# EAGLE design SK3000v3 - FINAL (EAGLE 7.1.0)
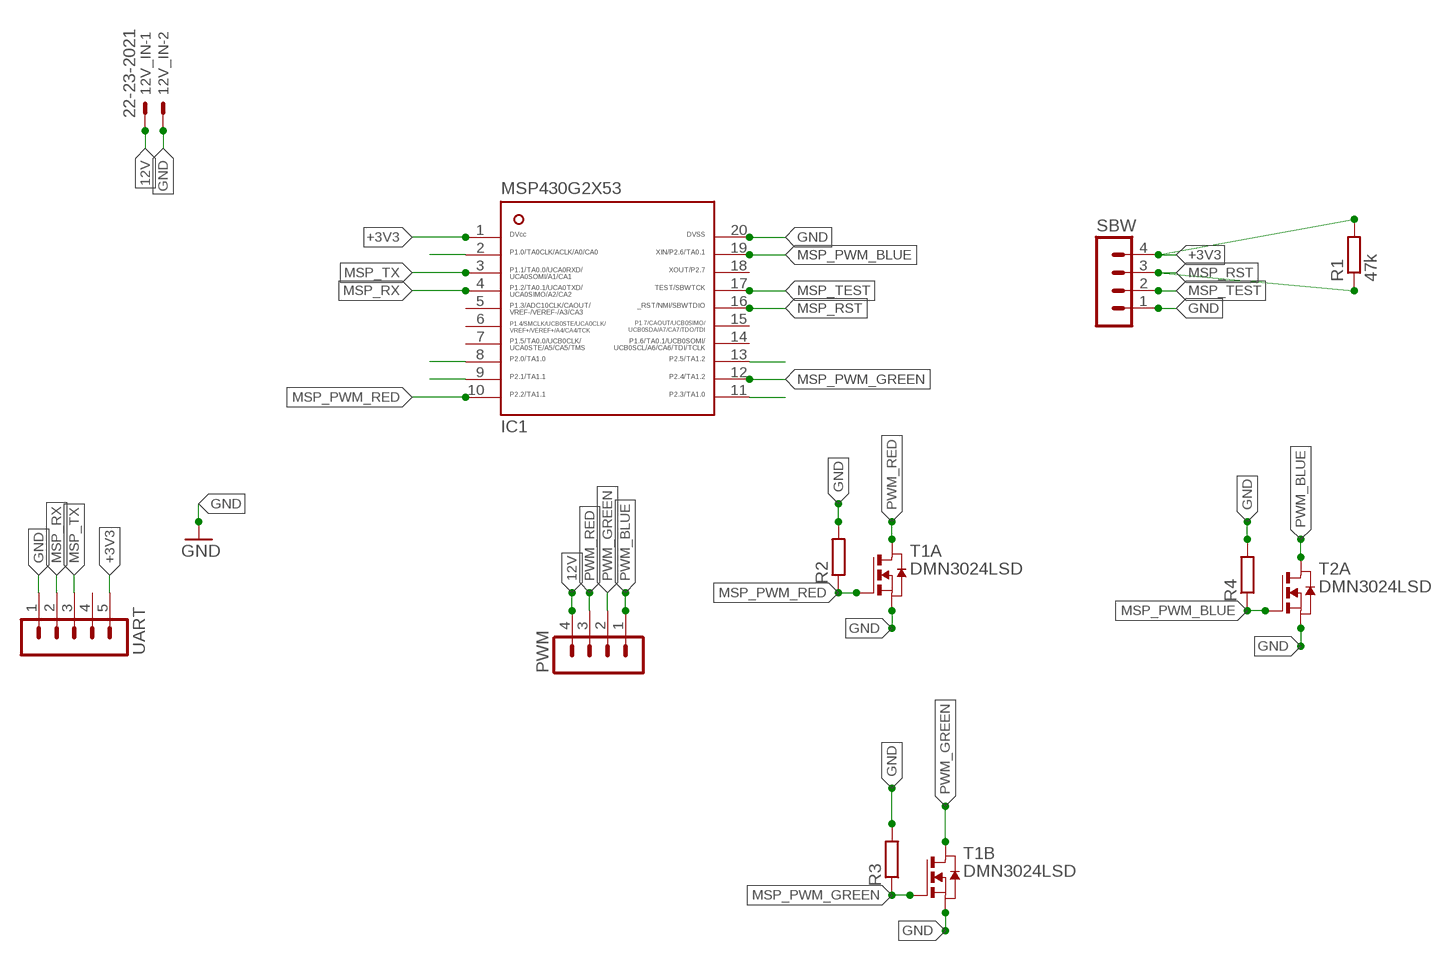
[diagram p0: schematic, sheet 1]

## Parts
12V_IN  22-23-2021  [22-23-2021]
IC1  MSP430G2553  MSP430G2X53-20PW20  [PW20]
PWM  MA04-1  [MA04-1]
R1  47k  R-EU_0207/5V  [0207/5V]
R2  R-EU_0207/5V  [0207/5V]
R3  R-EU_0207/5V  [0207/5V]
R4  R-EU_0207/5V  [0207/5V]
SBW  MA04-1  [MA04-1]
T1  DMN3024LSD  [SO8]
T2  DMN3024LSD  [SO8]
UART  MA05-1  [MA05-1]

## Nets
12V: 12V_IN.1 PWM.4
+3V3: IC1.1 R1.2 SBW.4 UART.5
GND: 12V_IN.2 IC1.20 R2.2 R3.2 R4.2 SBW.1 T1.1(A:S) T1.3(B:S) T2.1(A:S) UART.1
MSP_PWM_BLUE: IC1.19 R4.1 T2.2(A:G)
MSP_PWM_GREEN: IC1.12 R3.1 T1.4(B:G)
MSP_PWM_RED: IC1.10 R2.1 T1.2(A:G)
MSP_RST: IC1.16 R1.1 SBW.3
MSP_RX: IC1.4 UART.2
MSP_TEST: IC1.17 SBW.2
MSP_TX: IC1.3 UART.3
N$32: IC1.2
N$33: IC1.8
N$34: IC1.9
N$36: IC1.13
N$37: IC1.11
PWM_BLUE: PWM.1 T2.7(A:D) T2.8(A:D)
PWM_GREEN: PWM.2 T1.5(B:D) T1.6(B:D)
PWM_RED: PWM.3 T1.7(A:D) T1.8(A:D)
Unconnected: IC1.5 IC1.6 IC1.7 IC1.14 IC1.15 IC1.18 T2.3(B:S) T2.4(B:G) T2.5(B:D) T2.6(B:D) UART.4

## Library data of the parts
12V_IN = con-molex:22-23-2021: .100" (2.54mm) Center Header - 2 Pin; MF: MOLEX; MPN: 22-23-2021; OC_FARNELL: 1462926; OC_NEWARK: 25C3832
IC1 = ti_msp430:MSP430G2X53-20
PWM SBW = con-lstb:MA04-1: PIN HEADER; OC_FARNELL: unknown; OC_NEWARK: unknown
R1-R4 = rcl:R-EU_: RESISTOR, European symbol
T1 T2 = zetex:DMN3024LSD: 30V DUAL N-CHANNEL ENHANCEMENT MODE MOSFET Source: Data sheet <http://www.diodes.com/datasheets/DMN3024LSD.pdf>; OC_FARNELL: unknown; OC_NEWARK: unknown
UART = con-lstb:MA05-1: PIN HEADER; OC_FARNELL: unknown; OC_NEWARK: unknown

## Board
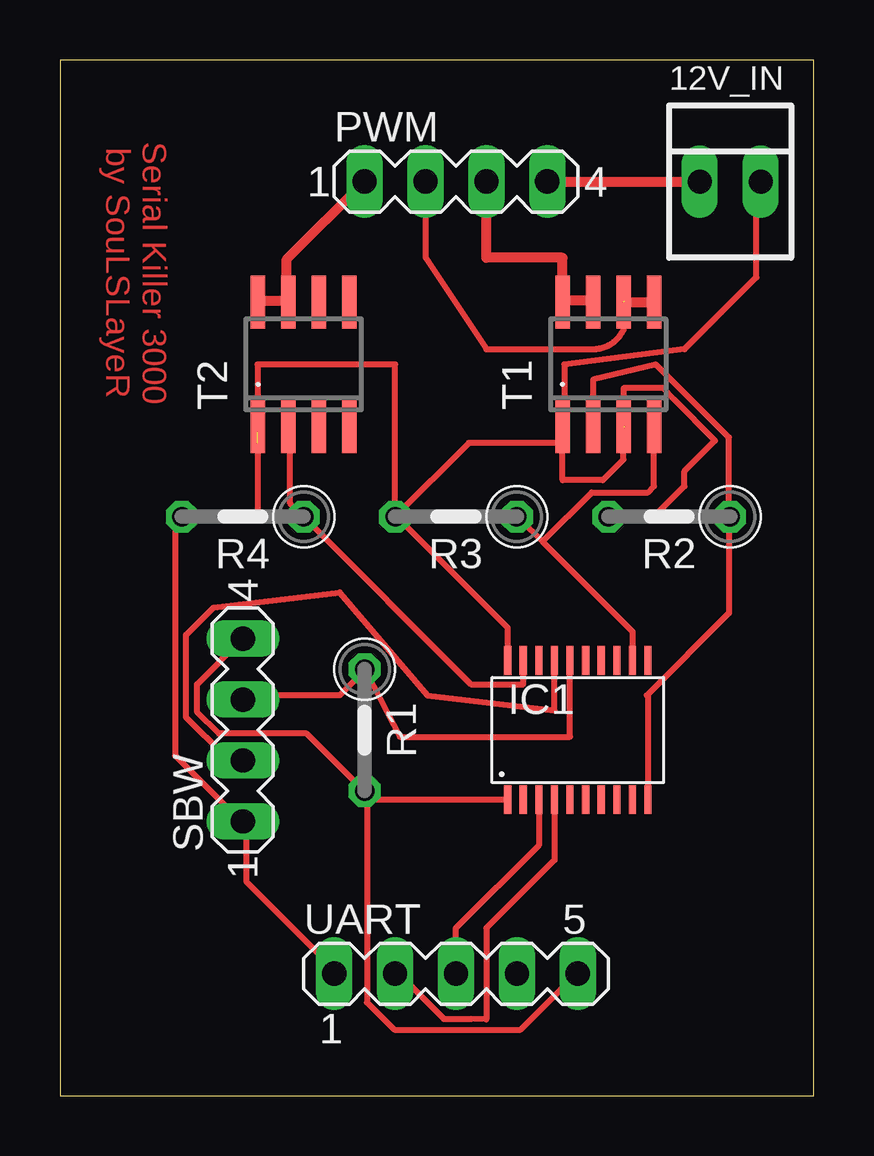
[diagram p1: board, top side]

Size 31.42 x 43.17 mm. Coordinates in mm from the lower left corner, seen from the top.
Outline: 0,0 31.42,0 31.42,43.17 0,43.17 0,0
Copper layers (1*16): Top 0.035mm / dielectric 1.5mm / Bottom 0.035mm
Design rules "default": minimum track width 10mil, minimum drill 24mil, track to track 8mil, track to pad 8mil, pad to pad 8mil, via to via 8mil, smd to smd 8mil, copper to edge 40mil, drill to drill 8mil, minimum pad ring 10mil, minimum via ring 8mil, stop-mask expansion 4mil, vias tented up to drill 0mil, thermal gap 10mil

### Footprints (pad centres in the part's own frame; a part is rotated, then mirrored left to right if it is on the bottom)
22-23-2021 = drill 1 long: 1 -1.27,0; 2 1.27,0
PW20 = smd 0.3 x 1.2: 1 -2.925,-2.9; 2 -2.275,-2.9; 3 -1.625,-2.9; 4 -0.975,-2.9; 5 -0.325,-2.9; 6 0.325,-2.9; 7 0.975,-2.9; 8 1.625,-2.9; 9 2.275,-2.9; 10 2.925,-2.9; 11 2.925,2.9; 12 2.275,2.9; 13 1.625,2.9; 14 0.975,2.9; 15 0.325,2.9; 16 -0.325,2.9; 17 -0.975,2.9; 18 -1.625,2.9; 19 -2.275,2.9; 20 -2.925,2.9
MA04-1 = drill 1.016 long: 1 -3.81,0; 2 -1.27,0; 3 1.27,0; 4 3.81,0
0207/5V = drill 0.813 octagon: 1 -2.54,0; 2 2.54,0
SO8 = smd 0.6 x 2.2: 1 -1.905,-2.6; 2 -0.635,-2.6; 3 0.635,-2.6; 4 1.905,-2.6; 5 1.905,2.6; 6 0.635,2.6; 7 -0.635,2.6; 8 -1.905,2.6
MA05-1 = drill 1.016 long: 1 -5.08,0; 2 -2.54,0; 3 0,0; 4 2.54,0; 5 5.08,0

### Placement (x,y rotation side)
12V_IN  27.94,38.1 0 top
IC1  21.59,15.24 0 top
PWM  16.51,38.1 0 top
R1  12.7,15.24 270 top
R2  25.4,24.13 180 top
R3  16.51,24.13 180 top
R4  7.62,24.13 180 top
SBW  7.62,15.24 90 top
T1  22.86,30.48 0 top
T2  10.16,30.48 0 top
UART  16.51,5.08 0 top

### Tracks (layer width: path | path; a pad name or v marks a point on that pad's centre or on a via)
12V
  Top 0.406: PWM.4 12V_IN.1
+3V3
  Top 0.254: 12.8,12.57 13.03,12.34 18.52,12.34 IC1.1 | SBW.4 5.71,17.14 5.71,16 6.63,15.09 10.29,15.09 12.57,12.8 R1.2 12.8,12.57 | 12.8,12.57 12.8,3.89 13.95,2.74 19.2,2.74 21.49,5.03 UART.5
GND  (2 unrouted)
  Top 0.254: 21.03,27.2 21.03,27.66 T1.1 | 23.55,27.89 23.55,28.57 | 22.86,24.23 R2.2 24.77,24.13 26.04,25.4 26.04,26.04 27.3,27.3 25.6,29.03 25.15,29.49 23.5,29.49 T1.3 23.5,26.52 22.63,25.65 20.95,25.65 20.95,27.2 | 12V_IN.2 29.03,37.95 29.03,34.11 26.04,31.11 21.03,30.48 21.03,27.89 T1.1 | UART.1 11.43,5.26 7.77,8.91 7.77,11.43 SBW.1 7.54,11.43 4.8,14.17 4.8,23.77 5.03,24 R4.2 5.26,24.23 8.26,24.23 8.26,27.2 | T2.1 8.23,27.66 8.23,30.48 13.97,30.48 R3.2 | R3.2 14.17,24 18.66,19.51 IC1.20 | 13.95,24 R3.2 | 20.95,27.2 21.03,27.2 | 21.03,27.2 T1.1 | 20.95,27.2 17.04,27.2 R3.2
  Top 0.406: 8.23,27.2 8.26,27.2
MSP_PWM_BLUE
  Top 0.254: T2.2 9.6,27.66 9.6,24.69 R4.1 17.14,17.14 19.32,17.14 IC1.19
MSP_PWM_GREEN
  Top 0.254: 20.12,23.09 19.2,24 R3.1 | 20.12,23.09 23.86,19.34 IC1.12 | 20.12,23.09 22.17,25.15 24.51,25.15 24.77,25.4 24.77,27.13 24.69,27.2 24.69,27.66 T1.4
MSP_PWM_RED
  Top 0.254: 22.4,28.8 22.4,27.89 T1.2 22.23,29.84 24.84,30.48 27.89,27.43 27.89,24.23 R2.1 27.89,24 27.89,20.12 24.46,16.69 arc-90 24.52,16.63 IC1.10
MSP_RST
  Top 0.254: 21.26,18.06 IC1.16 21.27,14.96 14.17,14.96 12.8,17.6 R1.1 12.57,17.6 11.66,16.69 7.77,16.69 SBW.3
MSP_RX
  Top 0.254: UART.2 14.17,5.03 16,3.2 17.14,3.2 17.78,3.17 17.78,6.99 20.61,9.82 IC1.4
MSP_TEST
  Top 0.254: 20.57,18.06 IC1.17 20.61,16.05 15.32,16.69 11.66,20.98 6.4,20.34 5.26,19.2 5.26,15.77 6.86,14.17 7.54,14.17 SBW.2
MSP_TX
  Top 0.254: UART.3 16.51,6.99 19.96,10.44 IC1.3
PWM_BLUE
  Top 0.254: 8.46,33.15 T2.8 | 9.37,33.15 T2.7
  Top 0.406: 8.46,33.15 9.46,33.15 | 9.46,33.15 T2.7 | 9.46,33.15 9.46,34.86 PWM.1
PWM_GREEN  (1 unrouted)
  Top 0.254: 24.69,33.15 T1.5 | PWM.2 15.24,34.92 17.78,31.11 22.23,31.11 arc114 T1.6 23.5,32.38
  Top 0.406: 23.55,33.15 23.61,33.08 T1.5
PWM_RED
  Top 0.254: 22.17,33.15 T1.7
  Top 0.406: 22.17,33.15 20.95,33.15 T1.8 20.95,34.92 17.78,34.92 PWM.3

### Text on the board
Top: Serial Killer 3000 / by SouLSLayeR